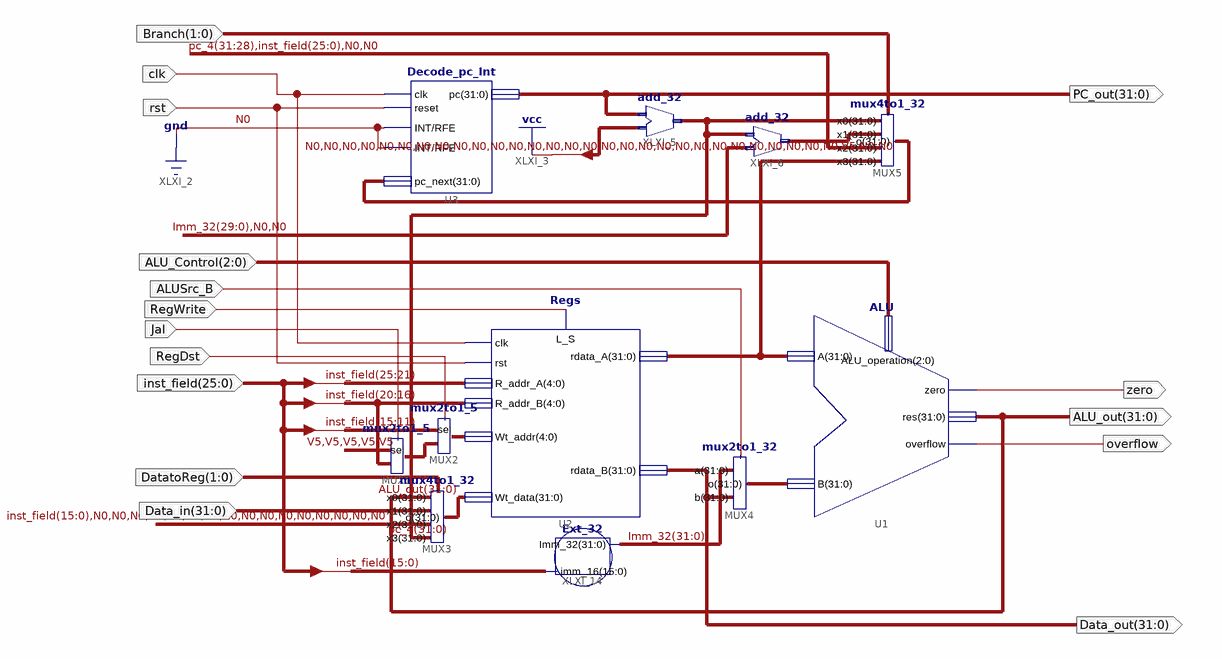
[diagram p0: schematic sheet 1]
// Xilinx ISE schematic Data_path.sch (spartan6) as structural Verilog: 11 symbols, 16 ports
module Data_path (
  input  [1:0] Branch,
  input  clk,
  input  rst,
  input  [2:0] ALU_Control,
  input  ALUSrc_B,
  input  RegWrite,
  input  [25:0] inst_field,
  input  RegDst,
  input  Jal,
  input  [31:0] Data_in,
  input  [1:0] DatatoReg,
  output [31:0] PC_out,
  output [31:0] Data_out,
  output [31:0] ALU_out,
  output zero,
  output overflow
);

  wire [4:0] XLXN_34, XLXN_111;
  wire [31:0] branch_pc, Imm_32, pc_4, pc_next, rdata_A, XLXN_31, XLXN_119;

  Decode_pc_Int U3 (.clk(clk), .pc(PC_out), .reset(rst), .INT(1'b0), .RFE(1'b0), .pc_next(pc_next));
  add_32 XLXI_5 (.a(PC_out), .b(32'b00000000000000000000000000000100), .c(pc_4));
  add_32 XLXI_6 (.a(pc_4), .b({Imm_32[29:0], 2'b00}), .c(branch_pc));
  ALU U1 (.zero(zero), .res(ALU_out), .overflow(overflow), .A(rdata_A), .B(XLXN_31), .ALU_operation(ALU_Control));
  Regs U2 (
    .clk(clk), .L_S(RegWrite), .rdata_A(rdata_A), .rst(rst), .Wt_data(XLXN_119), .rdata_B(Data_out),
    .R_addr_A(inst_field[25:21]), .R_addr_B(inst_field[20:16]), .Wt_addr(XLXN_34));
  mux2to1_32 MUX4 (.sel(ALUSrc_B), .a(Imm_32), .b(Data_out), .o(XLXN_31));
  Ext_32 XLXI_14 (.imm_16(inst_field[15:0]), .Imm_32(Imm_32));
  mux2to1_5 MUX2 (.sel(RegDst), .o(XLXN_34), .b(XLXN_111), .a(inst_field[15:11]));
  mux4to1_32 MUX5 (
    .sel(Branch), .x0(pc_4), .x1(branch_pc), .x2({pc_4[31:28], inst_field, 2'b00}), .x3(rdata_A), .o(pc_next));
  mux2to1_5 MUX1 (.sel(Jal), .o(XLXN_111), .b(inst_field[20:16]), .a({5{1'b1}}));
  mux4to1_32 MUX3 (
    .sel(DatatoReg), .x0(ALU_out), .x1(Data_in), .x2({inst_field[15:0], {16{1'b0}}}), .x3(pc_4), .o(XLXN_119));
endmodule
